# EAGLE design OpenEEW sensor board - ethernet (EAGLE 9.6.2)
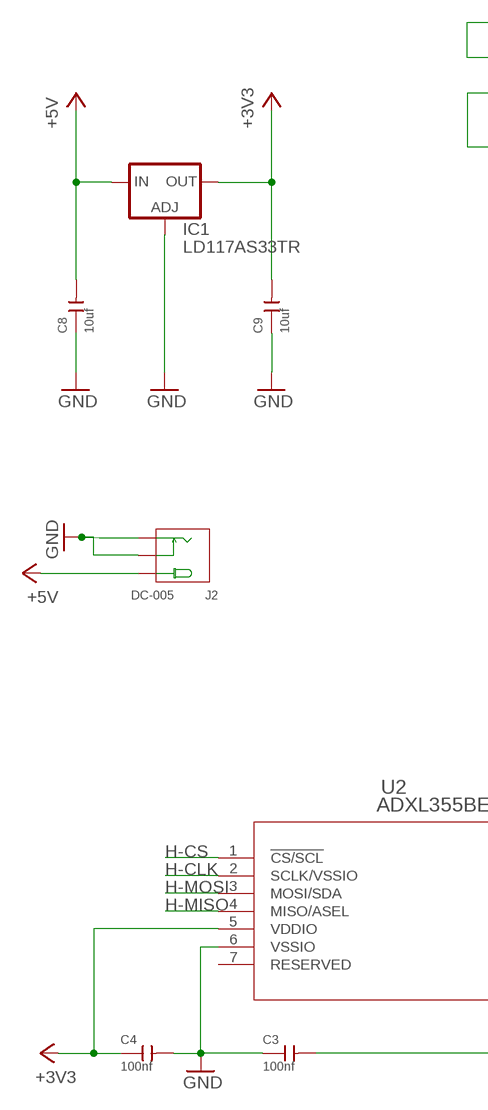
[diagram p0: schematic, sheet 1, part 1 of 2]
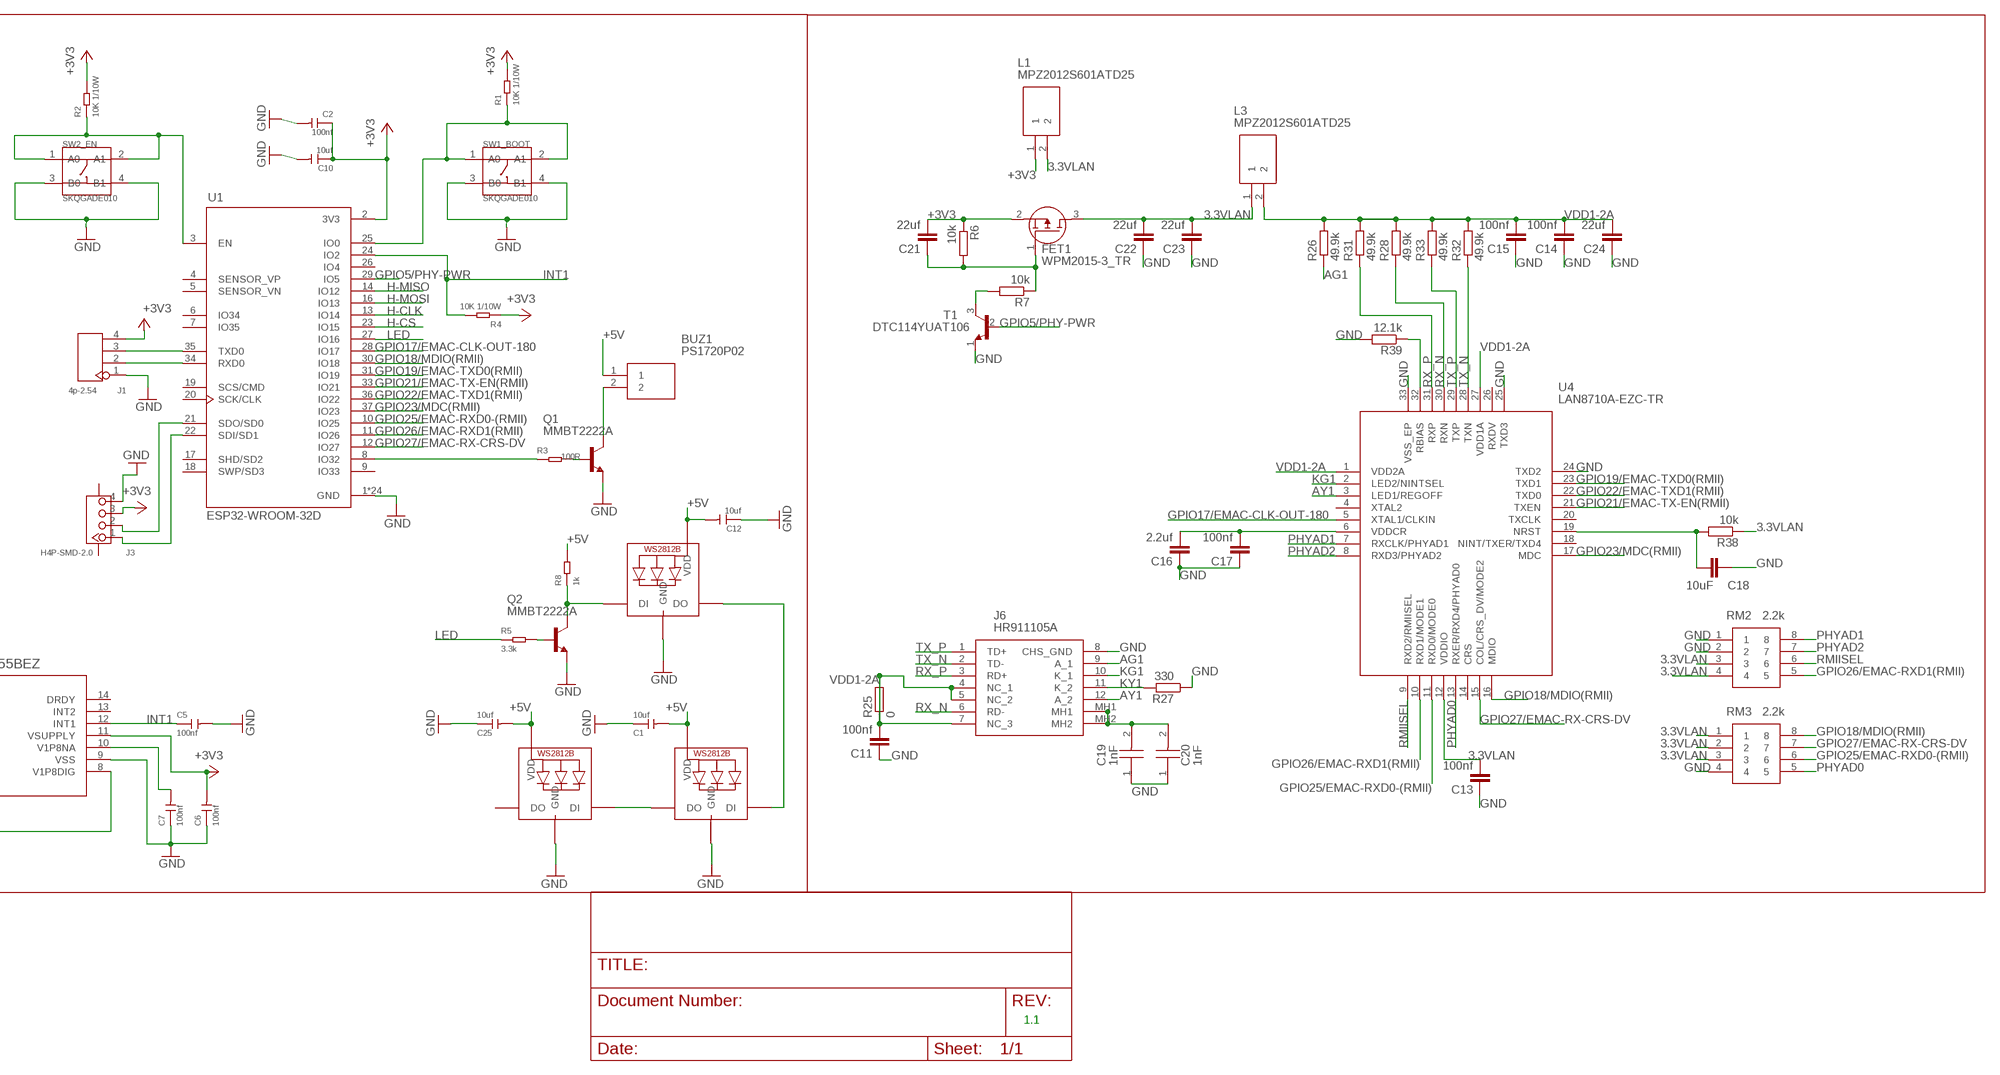
[diagram p1: schematic, sheet 1, part 2 of 2]

## Parts
BUZ1  PS1720P02  [PS17_1]
C1  10uf  CERAMIC-10UF-10V-10%-X5R(0603)  [C0603]
C2  100nf  CERAMIC-100NF-50V-10%-X7R(0603)  [C0603]
C3  100nf  CERAMIC-100NF-50V-10%-X7R(0603)  [C0603]
C4  100nf  CERAMIC-100NF-50V-10%-X7R(0603)  [C0603]
C5  100nf  CERAMIC-100NF-50V-10%-X7R(0603)  [C0603]
C6  100nf  CERAMIC-100NF-50V-10%-X7R(0603)  [C0603]
C7  100nf  CERAMIC-100NF-50V-10%-X7R(0603)  [C0603]
C8  10uf  CERAMIC-10UF-10V-10%-X5R(0603)  [C0603]
C9  10uf  CERAMIC-10UF-10V-10%-X5R(0603)  [C0603]
C10  10uf  CERAMIC-10UF-10V-10%-X5R(0603)  [C0603]
C11  100nf  C-EUC0603  [C0603]
C12  10uf  CERAMIC-10UF-10V-10%-X5R(0603)  [C0603]
C13  100nf  C-EUC0603  [C0603]
C14  100nf  C-EUC0603  [C0603]
C15  100nf  C-EUC0603  [C0603]
C16  2.2uf  C-EUC0603  [C0603]
C17  100nf  C-EUC0603  [C0603]
C18  10uF  C-EUC0603  [C0603]
C19  1nF  1206GC102KAT1A  [CAPC3317X180N]
C20  1nF  1206GC102KAT1A  [CAPC3317X180N]
C21  22uf  C-EUC0805  [C0805]
C22  22uf  C-EUC0805  [C0805]
C23  22uf  C-EUC0805  [C0805]
C24  22uf  C-EUC0603  [C0603]
C25  10uf  CERAMIC-10UF-10V-10%-X5R(0603)  [C0603]
FET1  WPM2015-3_TR  [SOT95P240X130-3N]
IC1  LD117AS33TR  [SOT223]
J1  4p-2.54  DIP-BLACK-MALE-HEADER-VERT(4P-2.54)  [H4-2.54]
J2  DC-005  CONN-POWER-JACK-2.1MM(DC-005)  [DCJ3P-14.2X11.0X9.0MM]
J3  H4P-SMD-2.0  GROVE-CONNECTOR-SMD(4+2P-2.0)  [HW4-SMD-2.0]
J6  HR911105A  [HR911105A]
L1  MPZ2012S601ATD25  [BEADC2012X105N]
L3  MPZ2012S601ATD25  [BEADC2012X105N]
LED1  WS2812B5050  [WS2812B]
LED2  WS2812B5050  [WS2812B]
LED3  WS2812B5050  [WS2812B]
Q1  MMBT2222A  [SOT23]
Q2  MMBT2222A  [SOT23]
R1  10K 1/10W  SMD-RES-10K-5%-1/10W(0603)  [R0603]
R2  10K 1/10W  SMD-RES-10K-5%-1/10W(0603)  [R0603]
R3  100R  SMD-RES-100R-5%-1/8W(0805)  [R0805]
R4  10K 1/10W  SMD-RES-10K-5%-1/10W(0603)  [R0603]
R5  3.3k  SMD-RES-300R-1%-1/10W(0603)  [R0603]
R6  10k  R-EU_R0603  [R0603]
R7  10k  R-EU_R0603  [R0603]
R8  1k  SMD-RES-100R-5%-1/8W(0805)  [R0805]
R25  0  R-EU_R0603  [R0603]
R26  49.9k  R-EU_R0603  [R0603]
R27  330  R-EU_R0603  [R0603]
R28  49.9k  R-EU_R0603  [R0603]
R31  49.9k  R-EU_R0603  [R0603]
R32  49.9k  R-EU_R0603  [R0603]
R33  49.9k  R-EU_R0603  [R0603]
R38  10k  R-EU_R0603  [R0603]
R39  12.1k  R-EU_R0603  [R0603]
RM2  2.2k  CAT10-103J4LF  [CAT10J4LF]
RM3  2.2k  CAT10-103J4LF  [CAT10J4LF]
SW1_BOOT  SKQGADE010  SMD-BUTTON(4P-5.2X5.2X1.5MM-SKQGADE010)-SKQGADE010  [SW4-SMD-5.2X5.2X1.5MM]
SW2_EN  SKQGADE010  SMD-BUTTON(4P-5.2X5.2X1.5MM-SKQGADE010)-SKQGADE010  [SW4-SMD-5.2X5.2X1.5MM]
T1  DTC114YUAT106  [SOT65P210X90-3N]
U1  ESP32-WROOM-32D  [MODULE_ESP32-WROOM-32D]
U2  ADXL355BEZ  [E_14_1_ADI]
U4  LAN8710A-EZC-TR  [QFN50P500X500X100-33N]

## Nets
3.3VLAN: C13.2 C22.2 C23.2 FET1.3(D) L1.2 L3.1 R38.1 RM2.3 RM2.4 RM3.1 RM3.2 RM3.3 U4.12(VDDIO)
+3V3: C2.1 C4.1 C6.2 C9.2 C10.1 C21.2 FET1.2(S) IC1.4(OUT) J1.4 J3.3 L1.1 R1.2 R2.2 R4.1 R6.1 U1.2(3V3) U2.5(VDDIO) U2.11(VSUPPLY)
+5V: BUZ1.1 C1.2 C8.2 C12.2 C25.2 IC1.3(IN) J2.+ LED1.1-VDD(VDD) LED2.1-VDD(VDD) LED3.1-VDD(VDD) R8.2
AG1: J6.9(A_1) R26.1
AY1: J6.12(A_2) U4.3(LED1/REGOFF)
GND: C1.1 C2.2 C3.1 C4.2 C5.2 C6.1 C7.1 C8.1 C9.1 C10.2 C11.1 C12.1 C13.1 C14.1 C15.1 C16.1 C17.1 C18.1 C19.1 C20.1 C22.1 C23.1 C24.1 C25.1 IC1.1(ADJ) J1.1 J2.-1(-) J2.-2(CDN) J3.4 J6.8(CHS_GND) LED1.3-GND(GND) LED2.3-GND(GND) LED3.3-GND(GND) Q1.2(E) Q2.2(E) R27.1 R39.2 RM2.1 RM2.2 RM3.4 SW1_BOOT.3(B0) SW1_BOOT.4(B1) SW2_EN.3(B0) SW2_EN.4(B1) T1.1(E) U1.1(GND) U1.15(GND) U1.38(GND) U1.39_1(GND) U1.39_2(GND) U1.39_3(GND) U1.39_4(GND) U1.39_5(GND) U1.39_6(GND) U1.39_7(GND) U1.39_8(GND) U1.39_9(GND) U1.39_10(GND) U1.39_11(GND) U1.39_12(GND) U1.39_13(GND) U1.39_14(GND) U1.39_15(GND) U1.39_16(GND) U1.39_17(GND) U1.39_18(GND) U1.39_19(GND) U1.39_20(GND) U1.39_21(GND) U2.6(VSSIO) U2.9(VSS) U4.24(TXD2) U4.25(TXD3) U4.33(VSS_EP)
GPIO5/PHY-PWR: T1.2(B) U1.29(IO5)
GPIO17/EMAC-CLK-OUT-180: U1.28(IO17) U4.5(XTAL1/CLKIN)
GPIO18/MDIO(RMII): RM3.8 U1.30(IO18) U4.16(MDIO)
GPIO19/EMAC-TXD0(RMII): U1.31(IO19) U4.23(TXD1)
GPIO21/EMAC-TX-EN(RMII): U1.33(IO21) U4.21(TXEN)
GPIO22/EMAC-TXD1(RMII): U1.36(IO22) U4.22(TXD0)
GPIO23/MDC(RMII): U1.37(IO23) U4.17(MDC)
GPIO25/EMAC-RXD0-(RMII): RM3.6 U1.10(IO25) U4.11(RXD0/MODE0)
GPIO26/EMAC-RXD1(RMII): RM2.5 U1.11(IO26) U4.10(RXD1/MODE1)
GPIO27/EMAC-RX-CRS-DV: RM3.7 U1.12(IO27) U4.15(COL/CRS_DV/MODE2)
H-CLK: U1.13(IO14) U2.2(SCLK/VSSIO)
H-CS: U1.23(IO15) U2.1(!CS/SCL)
H-MISO: U1.14(IO12) U2.4(MISO/ASEL)
H-MOSI: U1.16(IO13) U2.3(MOSI/SDA)
INT1: C5.1 R4.2 U1.24(IO2) U2.12(INT1)
KG1: J6.10(K_1) U4.2(LED2/NINTSEL)
KY1: J6.11(K_2) R27.2
LED: R5.1 U1.27(IO16)
N$1: C3.2 U2.8(V1P8DIG)
N$2: R1.1 SW1_BOOT.1(A0) SW1_BOOT.2(A1) U1.25(IO0)
N$3: C7.2 U2.10(V1P8NA)
N$4: R3.1 U1.8(IO32)
N$5: R2.1 SW2_EN.1(A0) SW2_EN.2(A1) U1.3(EN)
N$6: Q1.1(B) R3.2
N$7: J1.3 U1.35(TXD0)
N$8: J1.2 U1.34(RXD0)
N$9: J3.1 U1.22(SDI/SD1)
N$10: J3.2 U1.21(SDO/SD0)
N$11: LED1.4-DIN(DI) Q2.3(C) R8.1
N$12: BUZ1.2 Q1.3(C)
N$13: R7.2 T1.3(C)
N$14: Q2.1(B) R5.2
N$15: C16.2 C17.2 U4.6(VDDCR)
N$16: C21.1 FET1.1(G) R6.2 R7.1
N$17: LED1.2-DOUT(DO) LED2.4-DIN(DI)
N$18: C19.2 C20.2 J6.MH1 J6.MH2
N$19: LED2.2-DOUT(DO) LED3.4-DIN(DI)
N$25: C18.2 R38.2 U4.19(NRST)
N$26: R39.1 U4.32(RBIAS)
PHYAD0: RM3.5 U4.13(RXER/RXD4/PHYAD0)
PHYAD1: RM2.8 U4.7(RXCLK/PHYAD1)
PHYAD2: RM2.7 U4.8(RXD3/PHYAD2)
RMIISEL: RM2.6 U4.9(RXD2/RMIISEL)
RX_N [diff pairs]: J6.6(RD-) R28.1 U4.30(RXN)
RX_P [diff pairs]: J6.3(RD+) R31.1 U4.31(RXP)
TX_N [diff pairs]: J6.2(TD-) R32.1 U4.28(TXN)
TX_P [diff pairs]: J6.1(TD+) R33.1 U4.29(TXP)
VDD1-2A [diff pairs]: C11.2 C14.2 C15.2 C24.2 J6.4(NC_1) J6.5(NC_2) J6.7(NC_3) L3.2 R25.1 R25.2 R26.2 R28.2 R31.2 R32.2 R33.2 U4.1(VDD2A) U4.27(VDD1A)
Unconnected: J3.SS1 J3.SS2 LED3.2-DOUT(DO) U1.4(SENSOR_VP) U1.5(SENSOR_VN) U1.6(IO34) U1.7(IO35) U1.9(IO33) U1.17(SHD/SD2) U1.18(SWP/SD3) U1.19(SCS/CMD) U1.20(SCK/CLK) U1.26(IO4) U2.7(RESERVED) U2.13(INT2) U2.14(DRDY) U4.4(XTAL2) U4.14(CRS) U4.18(NINT/TXER/TXD4) U4.20(TXCLK) U4.26(RXDV)

## Notes on the sheet
- 1.1

## Library data of the parts
BUZ1 = SamacSys_Parts:PS1720P02: Piezoelectronic buzzers Pin terminal/Lead lines/SMD(Without oscillator circuit) Source: Datasheet <https://product.tdk.com/info/en/catalog/datasheets/piezoelectronic_buzzer_ps_en.pdf>; ARROW_PART_NUMBER: PS1720P02; ARROW_PRICE-STOCK: https://www.arrow.com/en/products/ps1720p02/tdk; DESCRIPTION: Piezoelectronic buzzers Pin terminal/Lead lines/SMD(Without oscillator circuit); HEIGHT: mm; MANUFACTURER_NAME: TDK; MANUFACTURER_PART_NUMBER: PS1720P02; MOUSER_PART_NUMBER: 810-PS1720P02; MOUSER_PRICE-STOCK: https://www.mouser.co.uk/ProductDetail/TDK/PS1720P02?qs=Ys7FABonMR4G5gkQPbK3uw%3D%3D
C1 C8-C10 C12 C25 = OPL_Capacitor:CERAMIC-10UF-10V-10%-X5R(0603): 302010103; MPN: CC0603KRX5R6BB106
C2-C7 = OPL_Capacitor:CERAMIC-100NF-50V-10%-X7R(0603): 302010138; MPN: CC0603KRX7R9BB104
C11 C13-C18 C21-C24 = rcl:C-EU: CAPACITOR, European symbol; SPICEPREFIX: C
C19 C20 = SamacSys_Parts:1206GC102KAT1A: 1206 X7R ceramic capacitor, 2kV 1nF AVX 1206 FlEXITERM 1nF Ceramic Multilayer Capacitor, 2000 V dc, +125C, X7R Dielectric, +/-10% SMD Source: Datasheet <https://componentsearchengine.com/Datasheets/2/1206GC102KAT1A.pdf>; ARROW_PART_NUMBER: 1206GC102KAT1A; ARROW_PRICE-STOCK: https://www.arrow.com/en/products/1206gc102kat1a/avx; DESCRIPTION: 1206 X7R ceramic capacitor, 2kV 1nF AVX 1206 FlEXITERM 1nF Ceramic Multilayer Capacitor, 2000 V dc, +125C, X7R Dielectric, +/-10% SMD; HEIGHT: 1.8mm; MANUFACTURER_NAME: AVX; MANUFACTURER_PART_NUMBER: 1206GC102KAT1A; MOUSER_PART_NUMBER: 581-1206GC102K; MOUSER_PRICE-STOCK: https://www.mouser.com/Search/Refine.aspx?Keyword=581-1206GC102K
FET1 = SamacSys_Parts:WPM2015-3_TR: MOSFET P Trench 20V 2.2A 810mV @ 250uA 110 m @ 2.7A,4.5V SOT-23(SOT-23-3) RoHS Source: Datasheet <https://lcsc.com/product-detail/MOSFET_Will-Semicon-WPM2015-3-TR_C213159.html>; ARROW_PART_NUMBER: WPM2015-3/TR; DESCRIPTION: MOSFET P Trench 20V 2.2A 810mV @ 250uA 110 m @ 2.7A,4.5V SOT-23(SOT-23-3) RoHS; HEIGHT: 1.3mm; MANUFACTURER_NAME: Will Semiconductor; MANUFACTURER_PART_NUMBER: WPM2015-3/TR
IC1 = v-reg:LD117A?*: Low drop fixed and adjustable positive voltage regulators 1 A Source: http://www.st.com/stonline/products/literature/ds/7194/ld1117axx.pdf
J1 = OPL_Connector:DIP-BLACK-MALE-HEADER-VERT(4P-2.54): 320020017; MPN: P125-1104A0BS116A1
J2 = OPL_Connector:CONN-POWER-JACK-2.1MM(DC-005): 320120003; MPN: DC-005
J3 = OPL_Connector@1:GROVE-CONNECTOR-SMD(4+2P-2.0): 320110030
J6 = SamacSys_Parts:HR911105A: Through Hole Ethernet Connectors/Modular Connectors (RJ45 RJ11) Source: Datasheet <https://datasheet.lcsc.com/szlcsc/Zhongshan-HanRun-Elec-HR911105A_C12074.pdf>; ARROW_PART_NUMBER: HR911105A; DESCRIPTION: Through Hole Ethernet Connectors/Modular Connectors (RJ45 RJ11); HEIGHT: 13.75mm; MANUFACTURER_NAME: HANRUN(Zhongshan HanRun Elec); MANUFACTURER_PART_NUMBER: HR911105A
L1 L3 = SamacSys_Parts:MPZ2012S601ATD25: Ferrite Beads Multi-Layer Power 600Ohm 25% 100MHz 2A 100mOhm DCR 0805 Automotive T/R Source: Datasheet <https://www.arrow.com/en/products/mpz2012s601atd25/tdk>; ARROW_PART_NUMBER: MPZ2012S601ATD25; ARROW_PRICE-STOCK: https://www.arrow.com/en/products/mpz2012s601atd25/tdk; DESCRIPTION: Ferrite Beads Multi-Layer Power 600Ohm 25% 100MHz 2A 100mOhm DCR 0805 Automotive T/R; HEIGHT: 1.05mm; MANUFACTURER_NAME: TDK; MANUFACTURER_PART_NUMBER: MPZ2012S601ATD25; MOUSER_PART_NUMBER: 810-MPZ2012S601ATD25; MOUSER_PRICE-STOCK: https://www.mouser.co.uk/ProductDetail/TDK/MPZ2012S601ATD25?qs=n0%2F4YYxsltT7vo9AjVUU7w%3D%3D
LED1-LED3 = adafruit:WS2812B
Q1 Q2 = MMBT2222A:MMBT2222A: 2N2222 General Purpose NPN Transistor; AVAILABILITY: Unavailable; DESCRIPTION: Bipolar (BJT) Transistor NPN 40V 600mA 300MHz 310mW Surface Mount SOT-23-3; MF: STMicroelectronics; MP: MMBT2222A; PACKAGE: TO-236-3 Taitron; PRICE: None
R1 R2 R4 = OPL_Resistor:SMD-RES-10K-5%-1/10W(0603): 301010293; MPN: RC0603JR-0710KL
R3 = OPL_Resistor:SMD-RES-100R-5%-1/8W(0805): 301010319; MPN: RC0805JR-07100RL
R5 = OPL_Resistor:SMD-RES-300R-1%-1/10W(0603): 301012063; MPN: RC0603FR-071K5L; VALUE: 1.5K
R6 R7 R25-R28 R31-R33 R38 R39 = rcl:R-EU_: RESISTOR, European symbol; SPICEPREFIX: R
R8 = OPL_Resistor:SMD-RES-100R-5%-1/8W(0805): 301010319; MPN: RC0805JR-07100RL; VALUE: 100R
RM2 RM3 = SamacSys_Parts:CAT10-103J4LF: 10k 0804 Thick Film Surface Mount Fixed Resistor +/-5% 0.0625W CAT10-103J4LF Source: Datasheet <https://www.bourns.com/pdfs/CAT10.pdf>; ARROW_PART_NUMBER: CAT10-103J4LF; ARROW_PRICE-STOCK: https://www.arrow.com/en/products/cat10-103j4lf/bourns; DESCRIPTION: 10k 0804 Thick Film Surface Mount Fixed Resistor +/-5% 0.0625W CAT10-103J4LF; HEIGHT: 0.55mm; MANUFACTURER_NAME: Bourns; MANUFACTURER_PART_NUMBER: CAT10-103J4LF; MOUSER_PART_NUMBER: 652-CAT10-103J4LF; MOUSER_PRICE-STOCK: https://www.mouser.co.uk/ProductDetail/Bourns/CAT10-103J4LF?qs=2W%2FSxbYhP0bqukjaie6S3A%3D%3D
SW1_BOOT SW2_EN = OPL_Switch:SMD-BUTTON(4P-5.2X5.2X1.5MM-SKQGADE010): 311020017; MPN: SKQGADE010
T1 = SamacSys_Parts:DTC114YUAT106: Rohm, Bip, Tr., BRT, DTC114YUAT106 ROHM, DTC114YUAT106 NPN Digital Transistor, 100 mA 50 V 10 kOhm, Ratio Of 4.7, 3-Pin SOT-323 Source: Datasheet <http://rohmfs.rohm.com/en/products/databook/datasheet/discrete/transistor/digital/dtc114yuat106-e.pdf>; ARROW_PART_NUMBER: DTC114YUAT106; DESCRIPTION: Rohm, Bip, Tr., BRT, DTC114YUAT106 ROHM, DTC114YUAT106 NPN Digital Transistor, 100 mA 50 V 10 kOhm, Ratio Of 4.7, 3-Pin SOT-323; HEIGHT: 0.9mm; MANUFACTURER_NAME: ROHM Semiconductor; MANUFACTURER_PART_NUMBER: DTC114YUAT106; MOUSER_PART_NUMBER: 755-DTC114YUAT106; MOUSER_PRICE-STOCK: https://www.mouser.co.uk/ProductDetail/ROHM-Semiconductor/DTC114YUAT106?qs=4kLU8WoGk0saqLEiRl69QA%3D%3D
U1 = andylib:ESP32-WROOM-32D: Bluetooth, WiFi 802.11b/g/n, Bluetooth v4.2 + EDR, Class 1, 2 and 3 Transceiver Module 2.4GHz ~ 2.5GHz Integrated, Trace Surface Mount; AVAILABILITY: Unavailable; DESCRIPTION: Bluetooth, WiFi 802.11b/g/n, Bluetooth v4.2 +EDR, Class 1, 2 and 3 Transceiver Module 2.4GHz ~ 2.5GHz Integrated, Trace Surface Mount; DIGIKEY-PURCHASE-URL: https://snapeda.com/shop?store=DigiKey&id=2768115; MF: Espressif Systems; MP: ESP32-WROOM-32D; PACKAGE: Module Espressif Systems; PRICE: None
U2 = andylib:ADXL355BEZ; BUILT_BY: Analog_Devices_Team; COPYRIGHT: Copyright (C) 2018 Accelerated Designs. All rights reserved; MANUFACTURER_PART_NUMBER: ADXL355BEZ; SOURCELIBRARY: Analog_Devices_2019-04-17; VENDOR: Analog Devices Inc
U4 = SamacSys_Parts:LAN8710A-EZC-TR: Ethernet ICs 10/100 Ethernet XCVR HP AutoMDIX FlexPwr Source: Datasheet <http://docs-emea.rs-online.com/webdocs/13a0/0900766b813a037a.pdf>; ARROW_PART_NUMBER: LAN8710A-EZC-TR; ARROW_PRICE-STOCK: https://www.arrow.com/en/products/lan8710a-ezc-tr/microchip-technology; DESCRIPTION: Ethernet ICs 10/100 Ethernet XCVR HP AutoMDIX FlexPwr; HEIGHT: 1mm; MANUFACTURER_NAME: Microchip; MANUFACTURER_PART_NUMBER: LAN8710A-EZC-TR; MOUSER_PART_NUMBER: 886-LAN8710A-EZC-TR; MOUSER_PRICE-STOCK: https://www.mouser.co.uk/ProductDetail/Microchip-Technology/LAN8710A-EZC-TR?qs=pA5MXup5wxGKmFN1hVUOmA%3D%3D

## Net classes
1 diff pairs: width 0.203 mm
2 Power: width 1 mm
3 signal: width 0.5 mm

## Board
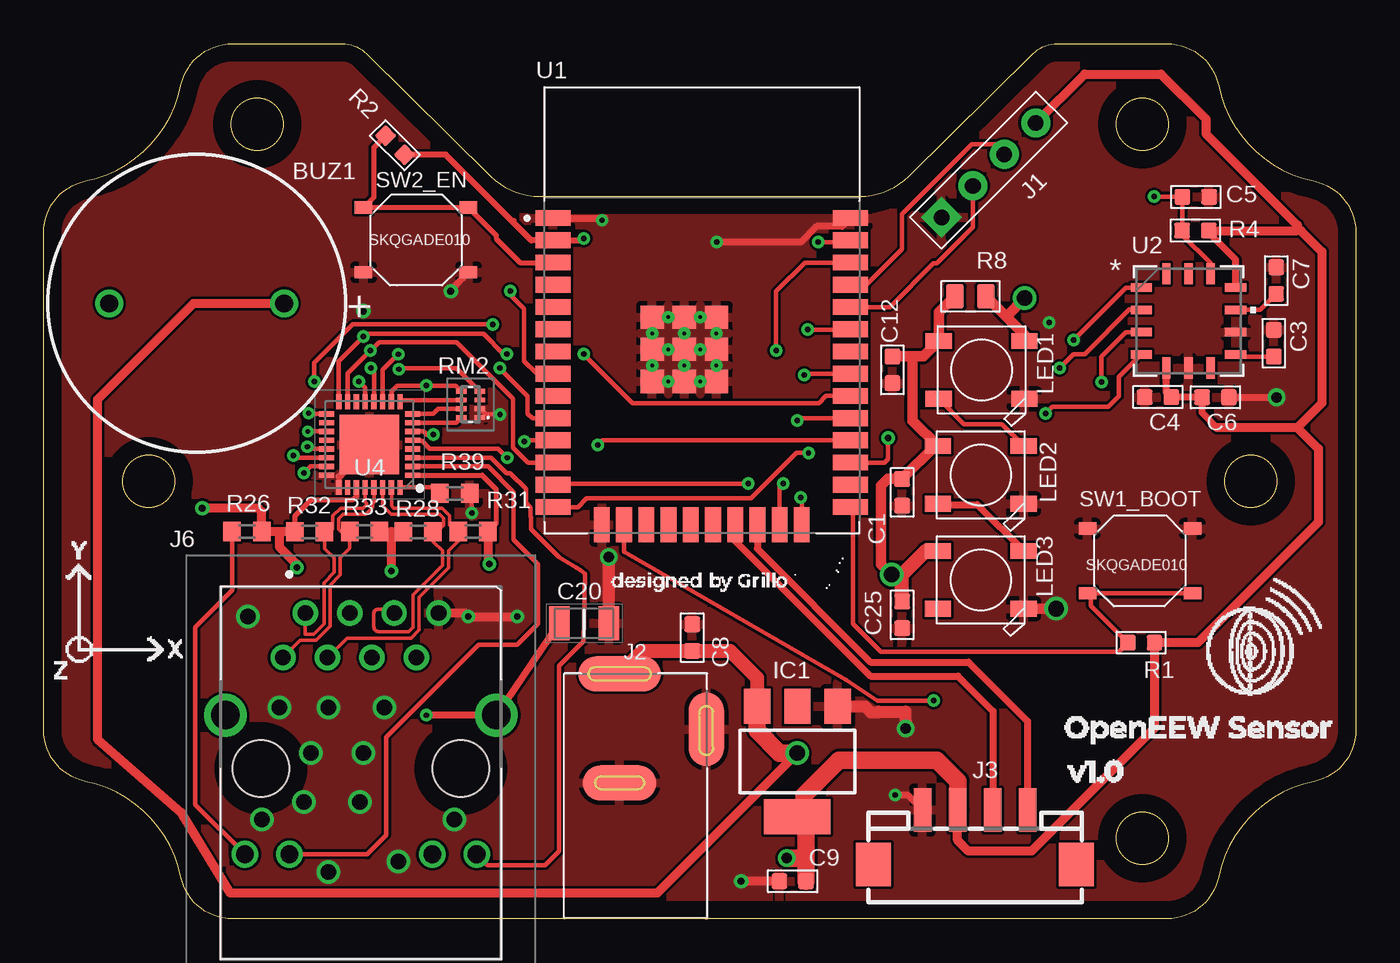
[diagram p2: board, top side]
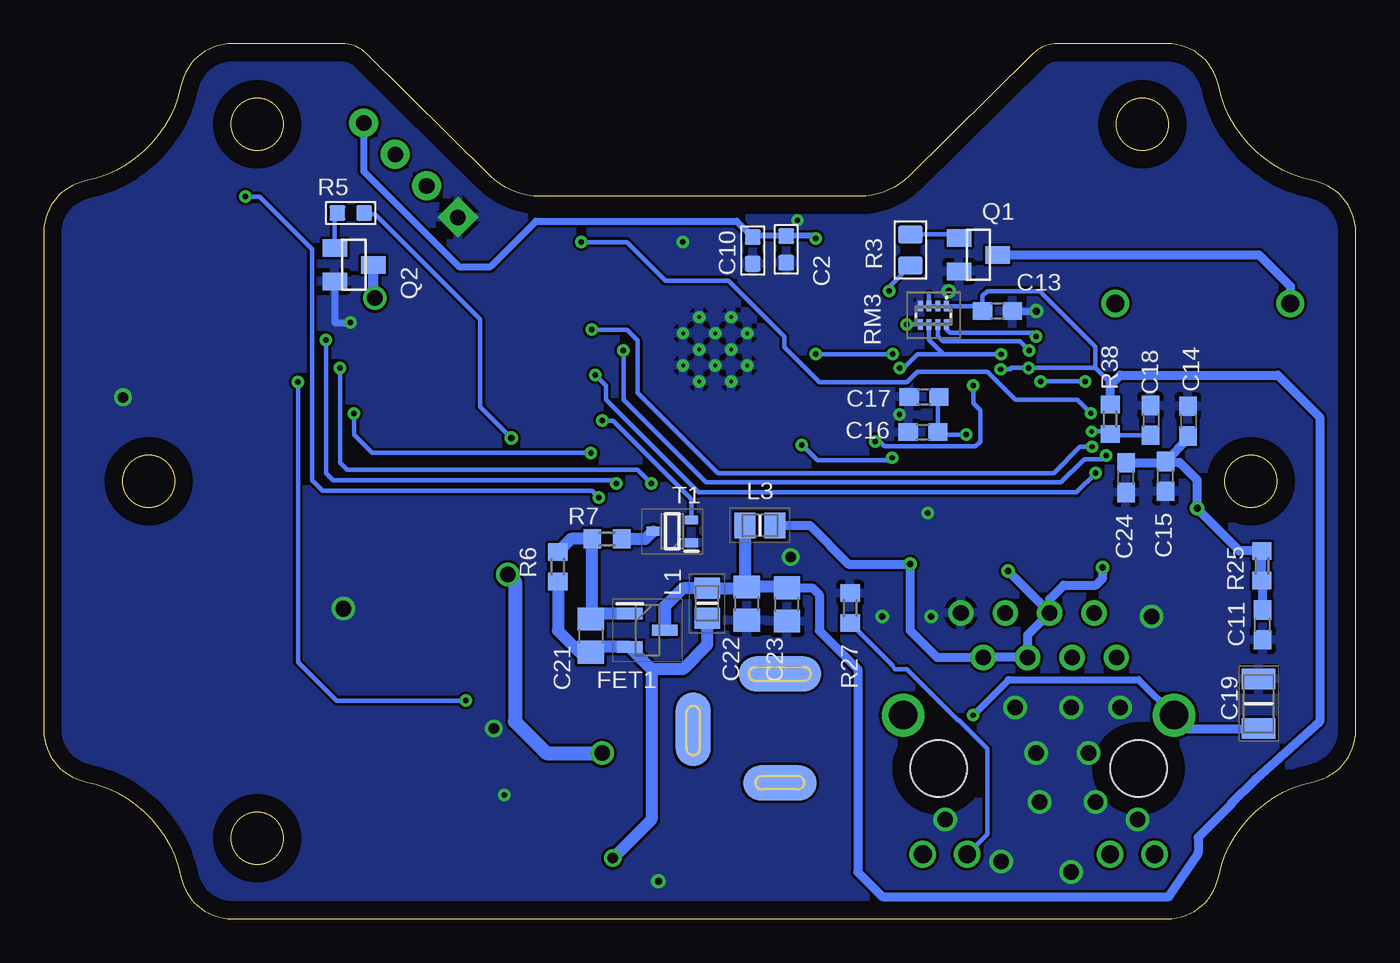
[diagram p3: board, bottom side, seen from below]

Size 75 x 50 mm. Coordinates in mm from the lower left corner, seen from the top.
Outline: 2.4,7.84 arc-78 0,10.78 0,39.23 arc-78 2.4,42.16 arc67 7.84,47.6 arc-78 10.78,50 17.05,50 arc-45 18.45,49.42 25.54,42.44 arc45 28.35,41.29 46.65,41.29 arc45 49.46,42.44 56.55,49.42 arc-45 57.95,50 64.22,50 arc-78 67.16,47.6 arc67 72.6,42.16 arc-78 75,39.23 75,10.78 arc-78 72.6,7.84 arc67 67.16,2.4 arc-78 64.22,0 10.78,0 arc-78 7.84,2.4 arc67 2.4,7.84
Outline: circle at 6,25 radius 1.5
Outline: circle at 12.2,45.4 radius 1.5
Outline: circle at 62.8,4.6 radius 1.5
Outline: circle at 69,25 radius 1.5
Outline: circle at 62.8,45.4 radius 1.5
Copper layers (1*16): Top 0.035mm / dielectric 1.5mm / Bottom 0.035mm
Design rules "default *": minimum track width 6mil, minimum drill 6mil, track to track 6mil, track to pad 6mil, pad to pad 6mil, via to via 6mil, smd to smd 6mil, copper to edge 40mil, drill to drill 6mil, minimum pad ring 10mil, minimum via ring 8mil, stop-mask expansion 4mil, vias tented up to drill 0mil, thermal gap 10mil

### Footprints (pad centres in the part's own frame; a part is rotated, then mirrored left to right if it is on the bottom)
PS17_1 = drill 1.02 pad 1.58: 1 -5,0; 2 5,0
C0603 = smd 0.889 x 0.889: 1 0,0.762; 2 0,-0.762
C0603' = smd 1.1 x 1: 1 -0.85,0; 2 0.85,0
CAPC3317X180N = smd 1.17 x 1.92: 1 -1.42,0; 2 1.42,0
C0805 = smd 1.3 x 1.5: 1 -0.95,0; 2 0.95,0
SOT95P240X130-3N = smd 1.45 x 0.65: 1 -1,0.95; 2 -1,-0.95; 3 1,0
SOT223 = smd 1.5 x 2: 1 -2.3,-3.15; 2 0,-3.15; 3 2.3,-3.15 | smd 3.8 x 2: 4 0,3.15
H4-2.54 = drill 0.889 pad 1.651 square: 1 0,3.81 | drill 0.889 pad 1.651: 2 0,1.27; 3 0,-1.27; 4 0,-3.81
DCJ3P-14.2X11.0X9.0MM = smd 2 x 4.7: + 3.175,0 | smd 2 x 4.7 bottom: +1 3.175,0 | smd 2 x 4.2: -1 -3.048,0 | smd 4.2 x 2: -2 0,-4.953 | smd 2 x 4.2 bottom: -3 -3.048,0 | smd 4.2 x 2 bottom: -4 0,-4.953
HW4-SMD-2.0 = smd 1 x 2.5: 1 -3,0; 2 -1,0; 3 1,0; 4 3,0 | smd 2 x 2.5: SS1 -5.8,3.123; SS2 5.8,3.123
HR911105A = drill 0.89 pad 1.446: 1 0,0; 2 -1.27,-2.54; 3 -2.54,0; 4 -3.81,-2.54; 5 -5.08,0; 6 -6.35,-2.54; 7 -7.62,0; 8 -8.89,-2.54 | drill 1.02 pad 1.53: 9 2.18,11.25; 10 -0.36,11.25; 11 -8.53,11.25; 12 -11.07,11.25 | drill 1.63 pad 2.445: MH1 -12.19,3.3; MH2 3.3,3.3 | hole 3.25: 1.27,6.35; -10.16,6.35
BEADC2012X105N = smd 1.2 x 1.45: 1 -0.85,0; 2 0.85,0
WS2812B = smd 1.5 x 0.9: 1-VDD 2.45,-1.65; 2-DOUT 2.45,1.65; 3-GND -2.45,1.65; 4-DIN -2.45,-1.65
SOT23 = smd 1 x 1.4: 1 -0.95,-1.1; 2 0.95,-1.1; 3 0,1.1
R0603 = smd 0.889 x 0.889: 1 0,0.762; 2 0,-0.762
R0805 = smd 1.397 x 1.016: 1 0,0.889; 2 0,-0.889
R0603' = smd 1 x 1.1: 1 -0.85,0; 2 0.85,0
CAT10J4LF = smd 0.275 x 0.6: 1 -0.75,-0.525; 2 -0.25,-0.525; 3 0.25,-0.525; 4 0.75,-0.525; 5 0.75,0.525; 6 0.25,0.525; 7 -0.25,0.525; 8 -0.75,0.525
SW4-SMD-5.2X5.2X1.5MM = smd 1 x 0.7: 1 -3,1.85; 2 3,1.85; 3 -3,-1.85; 4 3,-1.85
SOT65P210X90-3N = smd 0.75 x 0.5: 1 -1.1,0.65; 2 -1.1,-0.65; 3 1.1,0
MODULE_ESP32-WROOM-32D = smd 2 x 0.9: 1 -8.5,5.26; 2 -8.5,3.99; 3 -8.5,2.72; 4 -8.5,1.45; 5 -8.5,0.18; 6 -8.5,-1.09; 7 -8.5,-2.36; 8 -8.5,-3.63; 9 -8.5,-4.9; 10 -8.5,-6.17; 11 -8.5,-7.44; 12 -8.5,-8.71; 13 -8.5,-9.98; 14 -8.5,-11.25; 25 8.5,-11.25; 26 8.5,-9.98; 27 8.5,-8.71; 28 8.5,-7.44; 29 8.5,-6.17; 30 8.5,-4.9; 31 8.5,-3.63; 32 8.5,-2.36; 33 8.5,-1.09; 34 8.5,0.18; 35 8.5,1.45; 36 8.5,2.72; 37 8.5,3.99; 38 8.5,5.26 | smd 0.9 x 2: 15 -5.715,-12.25; 16 -4.445,-12.25; 17 -3.175,-12.25; 18 -1.905,-12.25; 19 -0.635,-12.25; 20 0.635,-12.25; 21 1.905,-12.25; 22 3.175,-12.25; 23 4.445,-12.25; 24 5.715,-12.25 | smd 1.33 x 1.33: 39_1 -2.835,-0.405; 39_2 -1,-0.405; 39_3 0.835,-0.405; 39_4 -2.835,-2.24; 39_5 -1,-2.24; 39_6 0.835,-2.24; 39_7 -2.835,-4.075; 39_8 -1,-4.075; 39_9 0.835,-4.075 | drill 0.2 pad 0.3: 39_10 -1.917,-0.405; 39_11 -0.083,-0.405; 39_12 -2.835,-1.323; 39_13 -1,-1.323; 39_14 0.835,-1.323; 39_15 -1.917,-2.24; 39_16 -0.083,-2.24; 39_17 -2.835,-3.158; 39_18 -1,-3.158; 39_19 0.835,-3.158; 39_20 -1.917,-4.075; 39_21 -0.083,-4.075
E_14_1_ADI = smd 1.219 x 0.483: 1 -2.695,1.905; 2 -2.695,0.635; 3 -2.695,-0.635; 4 -2.695,-1.905; 8 2.695,-1.905; 9 2.695,-0.635; 10 2.695,0.635; 11 2.695,1.905 | smd 0.483 x 1.219: 5 -1.27,-2.695; 6 0,-2.695; 7 1.27,-2.695; 12 1.27,2.695; 13 0,2.695; 14 -1.27,2.695
QFN50P500X500X100-33N = smd 0.85 x 0.3: 1 -2.45,1.75; 2 -2.45,1.25; 3 -2.45,0.75; 4 -2.45,0.25; 5 -2.45,-0.25; 6 -2.45,-0.75; 7 -2.45,-1.25; 8 -2.45,-1.75; 17 2.45,-1.75; 18 2.45,-1.25; 19 2.45,-0.75; 20 2.45,-0.25; 21 2.45,0.25; 22 2.45,0.75; 23 2.45,1.25; 24 2.45,1.75 | smd 0.3 x 0.85: 9 -1.75,-2.45; 10 -1.25,-2.45; 11 -0.75,-2.45; 12 -0.25,-2.45; 13 0.25,-2.45; 14 0.75,-2.45; 15 1.25,-2.45; 16 1.75,-2.45; 25 1.75,2.45; 26 1.25,2.45; 27 0.75,2.45; 28 0.25,2.45; 29 -0.25,2.45; 30 -0.75,2.45; 31 -1.25,2.45; 32 -1.75,2.45 | smd 3.4 x 3.4: 33 0,0

### Placement (x,y rotation side)
BUZ1  8.74,35.16 180 top
C1  49.07,24.37 180 top
C2  32.55,38.25 0 bottom
C3  70.31,32.89 0 top
C4  63.69,29.81 270 top
C5  65.85,41.25 90 top
C6  66.98,29.8 270 top
C7  70.45,36.47 0 top
C8  37.07,16.07 0 top
C9  42.81,2.14 90 top
C10  34.47,38.19 0 bottom
C11  100nf  [C0603']  5.33,16.8 90 bottom
C12  48.51,31.37 180 top
C13  100nf  [C0603']  20.48,34.73 180 bottom
C14  100nf  [C0603']  9.59,28.44 270 bottom
C15  100nf  [C0603']  10.88,25.28 90 bottom
C16  2.2uf  [C0603']  24.73,27.81 0 bottom
C17  100nf  [C0603']  24.68,29.83 0 bottom
C18  10uF  [C0603']  11.73,28.48 270 bottom
C19  5.55,12.29 270 bottom
C20  30.89,16.89 180 top
C21  43.73,16.18 270 bottom
C22  34.81,18.01 90 bottom
C23  32.51,17.96 90 bottom
C24  22uf  [C0603']  13.13,25.21 90 bottom
C25  49.07,17.37 180 top
FET1  40.49,16.49 0 bottom
IC1  43.08,8.99 180 top
J1  54.01,42.78 135 top
J2  32.92,10.82 90 top
J3  53.24,6.22 180 top
J6  13.68,14.93 180 top
L1  37.08,18.03 90 bottom
L3  34.06,22.48 0 bottom
LED1  53.61,31.36 180 top
LED2  53.57,25.37 180 top
LED3  53.57,19.37 180 top
Q1  21.58,37.94 270 bottom
Q2  57.27,37.37 270 bottom
R1  62.73,15.78 90 top
R2  20.08,44.21 45 top
R3  25.46,38.22 180 bottom
R4  65.83,39.33 270 top
R5  57.45,40.33 270 bottom
R6  10k  [R0603']  45.61,20.12 90 bottom
R7  10k  [R0603']  42.8,21.71 0 bottom
R8  52.97,35.57 270 top
R25  0  [R0603']  5.37,20.17 270 bottom
R26  49.9k  [R0603']  11.61,22.13 0 top
R27  330  [R0603']  28.9,17.76 270 bottom
R28  49.9k  [R0603']  21.41,22.11 180 top
R31  49.9k  [R0603']  24.54,22.13 0 top
R32  49.9k  [R0603']  15.21,22.11 180 top
R33  49.9k  [R0603']  18.34,22.13 0 top
R38  10k  [R0603']  14.03,28.54 270 bottom
R39  12.1k  [R0603']  23.5,24.31 0 top
RM2  24.4,29.39 90 top
RM3  24.14,34.48 180 bottom
SW1_BOOT  62.67,20.45 180 top
SW2_EN  21.28,38.79 0 top
T1  39.07,22.14 180 bottom
U1  37.62,34.78 0 top
U2  65.44,34.16 0 top
U4  18.62,27.09 180 top

### Tracks (layer width: path | path; a pad name or v marks a point on that pad's centre or on a via)
3.3VLAN  (via drill 0.3)
  Top 0.254: RM2.3 RM2.4 23.59,31.47 20.37,31.47 v20.31,31.4 | v18.7,31.47 18.88,31.3 U4.12
  Bottom 0.254: 14.9,31.47 14.03,30.61 | 14.9,31.47 v18.7,31.47 19.67,31.47 | 14.9,31.47 14.9,32.7 18.07,35.87 21.07,35.87 21.33,35.61 C13.2 21.61,35.01 RM3.1 RM3.2 RM3.3 24.39,35.67 | 19.67,31.47 19.7,31.47 | v20.31,31.4 19.74,31.4 19.67,31.47
  Bottom 0.5: R38.1 14.03,30.61 13.93,30.61 13.47,31.07 4.47,31.07 2.07,28.67 2.07,11.26 5.72,7.98 7.13,6.57 7.13,6.52 9.01,4.64 9.01,3.75 10.67,1.27 10.68,1.27 27.07,1.27 28.47,2.67 28.47,14.27 30.67,16.47 30.67,18.51 31.07,18.91 C23.2
  Bottom 0.7: C22.2 34.89,18.88 L1.2 38.47,18.88 39.49,17.86 FET1.3 | L3.1 34.91,19.06 C22.2 | C23.2 32.56,18.96 C22.2
+3V3  (via drill 0.3, 0.6)
  Top 0.35: v30.87,38.87 30.87,38.77 U1.2 27.87,38.77 26.87,39.77 | 26.87,39.77 26.87,39.87 | R2.2 22.97,43.67 26.87,39.77
  Top 0.4: U2.5 64.17,30.09 C4.1 64.46,29.8 C6.2 66.21,28.92 67.07,28.07 | R4.1 66.59,39.2 68.14,37.66 U2.11 | 71.67,39.33 71.87,39.33
  Top 0.5: R4.1 71.67,39.33 71.67,39.63 66.44,44.87 66.44,45.7 63.87,48.27 59.5,48.27 J1.4 | 71.87,39.33 73.07,38.13 73.07,29.47 71.67,28.07 | 71.67,28.07 67.07,28.07 | 71.67,28.07 72.87,26.87 72.87,22.67 65.98,15.78 R1.2 63.49,10.89 56.47,3.87 52.87,3.87 52.24,4.5 J3.3 | 43.37,3.47 43.57,3.27
  Top 1: C9.2 43.57,3.27 43.57,5.35 IC1.4 43.47,6.23 43.47,7.07 45.47,9.07 51.07,9.07 52.27,7.87 52.27,6.25 J3.3 | v42.47,3.47 43.37,3.47
  Bottom 0.35: v30.87,38.87 31.02,39.02 C2.1 34.41,39.02 C10.1
  Bottom 0.4: J1.4 56.71,42.7 51.27,37.27 49.47,37.27 46.87,39.87 35.39,39.87 C10.1
  Bottom 0.7: R6.1 45.61,16.47 44.37,15.23 C21.2 43.42,15.54 FET1.2 41.49,15.49 40.27,14.27 | 40.27,14.27 38.47,14.27 37.08,15.66 L1.1 | v42.47,3.47 40.27,5.67 40.27,14.27
+5V  (via drill 0.9)
  Top 0.254: 49.23,25.13 C1.2
  Top 0.5: BUZ1.1 8.56,35.16 3.07,29.67 3.07,10.27 7.87,6.07 10.67,1.47 35.07,1.47 v43.07,9.47
  Top 0.6: 49.87,32.13 50.28,32.13 LED1.1-VDD 51.16,34.65 R8.2 | 49.87,32.13 C12.2 | 49.87,32.13 49.67,31.93 49.67,28.47 LED2.1-VDD 50.96,27.02 C1.2 48.27,25.13 47.87,24.73 47.87,20.27 v48.47,19.67
  Top 0.8: C25.2 49.07,19.67 | 49.07,19.67 50.42,21.02 LED3.1-VDD | 49.07,19.67 v48.47,19.67 | J2.+ 34.23,15.31 C8.2 39.23,15.31 40.78,13.76 IC1.3
  Top 1: IC1.3 40.78,10.76 42.07,9.47 v43.07,9.47
  Bottom 0.8: v48.47,19.67 48.07,19.27 48.07,11.27 46.27,9.47 v43.07,9.47
AG1
  Top 0.254: R26.1 10.76,18.76 8.67,16.67 8.67,6.51 J6.9
AY1
  Top 0.254: J6.12 25.37,3.07 28.67,3.07 29.47,3.87 29.47,14.47 30.86,15.85 30.94,19.72 30.69,19.93 30.47,20.07 29.47,20.67 27.87,22.27 27.87,22.93 27.84,22.96 27.84,23.5 27.57,23.77 27.57,24.57 26.67,25.47 26.45,25.47 25.58,26.34 U4.3
GND  (via drill 0.3, 0.35, 0.4, 0.6, 0.9)
  Top 0.254: R39.2 24.47,24.19 v24.47,23.19 | v26.09,28.82 25.24,28.82 RM2.2
  Top 0.3: U4.25 16.88,25.27
  Top 0.4: U1.1 32.07,40.04 31.95,39.91 v31.91,39.91 | U1.38 45.65,39.57 44.18,39.57 43.27,38.67 v38.47,38.67 | J3.4 49.39,7.07 v48.67,7.07 | 16.88,25.27 17.47,25.87 17.67,25.87 17.67,26.14 U4.33 | SW2_EN.4 23.27,35.93 v23.27,35.87 | C6.1 v70.47,29.8
  Top 0.5: J6.8 24.07,17.47 v24.27,17.27 v27.07,17.27 | C9.1 v39.87,2.14
  Top 0.6: LED3.3-GND v57.87,17.72
  Top 0.7: IC1.1 46.94,12.14 47.28,11.8 47.69,11.8 47.73,11.84 49.27,11.84 v49.27,10.87 | C20.1 v32.31,20.67
  Bottom 0.4: Q2.2 58.37,34.07 v57.47,34.07 | C13.1 v18.27,34.73
  Bottom 0.5: v27.07,17.27 27.13,17.21
  other vias: 13.47,12.07 16.27,12.07 19.47,12.07 15.27,9.47 18.27,9.47 14.87,6.67 18.07,6.67 20.27,3.27 16.27,2.67 23.47,5.67 12.47,5.67 11.67,17.27
  pour Bottom: -5.33,52.07 -6.53,50.87 -6.53,6.87 6.67,-6.33 67.87,-6.33 81.47,7.27 81.47,43.67 69.47,55.67 -2.13,55.67 -5.33,52.47
  pour Top: 0.27,53.87 -3.93,49.67 -3.93,4.67 4.87,-4.13 66.67,-4.13 78.27,7.47 78.27,43.47 68.27,53.47 0.67,53.47
GPIO5/PHY-PWR  (via drill 0.3)
  Top 0.254: v43.07,28.47 43.21,28.61 U1.29
  Bottom 0.254: v43.07,28.47 42.47,28.47 37.97,23.97 T1.2
GPIO17/EMAC-CLK-OUT-180  (via drill 0.3)
  Top 0.254: 46.05,27.27 U1.28 31.93,27.34 v31.67,27.07 | U4.5 21.51,27.34 21.54,27.31 21.63,27.31 22.07,26.87 25.97,26.87 v26.49,26.34
  Bottom 0.254: v31.67,27.07 30.78,26.19 26.69,26.19 26.69,26.14 v26.49,26.34
GPIO18/MDIO(RMII)  (via drill 0.3)
  Top 0.254: U4.16 16.87,31.87 v18.27,33.27 18.44,33.44 25.13,33.44 26.3,32.27 v26.47,32.27 | U1.30 44.72,29.88 44.31,29.47 33.67,29.47 v30.87,32.27
  Bottom 0.254: RM3.8 23.39,33.68 23.2,33.49 18.49,33.49 v18.27,33.27 | v30.87,32.27 v26.47,32.27
GPIO19/EMAC-TXD0(RMII)  (via drill 0.3)
  Top 0.254: U4.23 15.25,25.84 v14.87,25.47 | v43.47,31.07 43.55,31.15 U1.31
  Bottom 0.254: v14.87,25.47 15.97,24.37 37.57,24.37 42.87,29.67 42.87,30.47 v43.47,31.07
GPIO21/EMAC-TX-EN(RMII)  (via drill 0.3)
  Top 0.254: U4.21 15.2,26.84 v15.07,26.97 | v43.67,33.67 46.1,33.67 U1.33
  Bottom 0.254: v15.07,26.97 15.77,26.97 17.27,25.47 36.47,25.47 41.07,30.07 41.07,33.07 41.67,33.67 v43.67,33.67
GPIO22/EMAC-TXD1(RMII)  (via drill 0.3)
  Top 0.254: U4.22 15.3,26.34 15.29,26.34 14.4,26.34 v14.27,26.47 | v41.87,32.47 41.87,35.87 43.5,37.5 U1.36
  Bottom 0.254: v14.27,26.47 14.47,26.27 15.52,26.27 16.85,24.94 37.14,24.94 41.87,29.67 v41.87,32.47
GPIO23/MDC(RMII)  (via drill 0.3)
  Top 0.254: U4.17 15.19,28.84 v15.14,28.89 | v44.27,38.67 46.02,38.67 U1.37
  Bottom 0.254: v15.14,28.89 15.93,29.67 19.47,29.67 21.07,31.27 25.07,31.27 25.67,30.67 30.67,30.67 32.67,32.67 32.67,33.27 35.87,36.47 39.47,36.47 41.67,38.67 v44.27,38.67
GPIO25/EMAC-RXD0-(RMII)  (via drill 0.3)
  Top 0.254: U4.11 19.38,31.37 v20.27,32.26 v20.28,32.27 | v26.07,31.47 27.67,29.87 27.67,28.87 27.93,28.61 U1.10
  Bottom 0.254: RM3.6 24.39,33.09 23.57,32.27 | 23.57,32.27 20.47,32.27 20.46,32.26 v20.27,32.26 | 23.57,32.27 25.07,32.27 25.87,31.47 v26.07,31.47
GPIO26/EMAC-RXD1(RMII)  (via drill 0.3)
  Top 0.254: U4.10 19.89,29.56 19.89,30.14 20.21,30.47 v21.87,30.47 23.54,30.47 RM2.5 | v27.47,27.27 27.54,27.34 U1.11
  Bottom 0.254: v21.87,30.47 21.87,29.47 21.47,29.07 21.47,27.27 21.74,26.99 26.94,26.99 27.21,27.27 v27.47,27.27
GPIO27/EMAC-RX-CRS-DV  (via drill 0.3)
  Top 0.254: U4.15 17.38,31.17 18.48,32.27 v18.68,32.47 19.16,32.95 23.59,32.95 26.83,29.71 26.83,26.91 27.67,26.07 U1.12
  Bottom 0.254: RM3.7 23.89,33.29 23.59,32.99 19.2,32.99 v18.68,32.47
H-CLK  (via drill 0.3)
  Top 0.254: U2.2 62.07,34.79 62.07,34.82 59.52,32.27 58.87,32.27 v58.07,31.47 | U1.13 29.19,24.87 v40.27,24.87
  Bottom 0.254: v58.07,31.47 58.07,26.07 57.67,25.67 41.07,25.67 v40.27,24.87
H-CS  (via drill 0.3)
  Top 0.254: U2.1 61.87,36.06 61.87,36.07 v58.87,33.07 | v42.27,24.87 42.07,24.66 U1.23
  Bottom 0.254: v58.87,33.07 58.87,25.47 58.47,25.06 42.47,25.06 v42.27,24.87
H-MISO  (via drill 0.3)
  Top 0.254: U1.14 30.53,23.53 31.04,24.04 40.44,24.04 43.02,26.62 v43.72,26.62 | U2.4 61.47,30.98 61.47,29.87 60.87,29.27 57.67,29.27 v57.27,28.87
  Bottom 0.254: v57.27,28.87 57.27,27.67 56.22,26.62 v43.72,26.62
H-MOSI  (via drill 0.3)
  Top 0.254: U1.16 33.18,20.96 45.87,13.67 47.67,12.47 v50.87,12.47 | U2.3 61.87,33.52 60.47,32.12 v60.47,30.67
  Bottom 0.254: v50.87,12.47 58.27,12.47 60.47,14.67 v60.47,30.67
INT1  (via drill 0.3)
  Top 0.254: U1.24 43.34,24.07 v43.27,24.07 | 65.07,41.27 v63.47,41.27 | C5.1 65.09,39.35 | R4.2 65.07,39.09 66.71,37.45 U2.12
  Top 0.4: C5.1 65.07,41.27 | 65.09,39.35 R4.2
  Bottom 0.254: v43.27,24.07 43.67,24.47 59.07,24.47 59.67,25.07 59.67,38.27 62.67,41.27 v63.47,41.27
KG1
  Top 0.254: U4.2 25.4,25.84 26.87,24.37 26.87,21.67 28.27,20.27 28.27,16.87 27.07,15.67 24.87,15.67 19.57,10.37 19.57,4.77 18.49,3.68 J6.10
KY1
  Bottom 0.254: J6.11 21.07,4.82 21.07,9.73 22.7,11.35 22.75,11.35 25.67,14.27 26.34,14.27 26.49,14.5 R27.2
LED  (via drill 0.35)
  Top 0.254: v48.27,27.47 48.27,26.27 48.07,26.07 U1.27
  Bottom 0.254: v48.27,27.47 50.07,29.27 50.07,34.27 56.07,40.27 56.63,40.27 R5.1
N$1
  Top 0.254: C3.2 68.26,32.13 U2.8
N$2
  Top 0.254: 47.01,23.53 U1.25 46.27,23.38 46.27,16.87 47.87,15.27 61.46,15.27 R1.1 59.87,17.88 59.87,18.6 | SW1_BOOT.2 59.87,18.6 | 59.87,18.6 SW1_BOOT.1
N$3
  Top 0.254: C7.2 69.54,34.79 U2.10
N$4  (via drill 0.3)
  Top 0.254: U1.8 28.19,31.15 27.47,31.87 27.47,34.87 26.67,35.67 v26.67,35.87
  Bottom 0.254: R3.1 26.67,36.12 v26.67,35.87
N$5
  Top 0.3: U1.3 27.24,37.5 25.87,38.87 25.87,39.05 SW2_EN.2 SW2_EN.1 18.87,41.23 18.87,44.07 19.54,44.73 R2.1
N$6
  Bottom 0.254: R3.2 22.9,39.1 Q1.1
N$7
  Top 0.254: J1.3 54.47,44.11 54.47,44.27 53.07,44.27 49.07,40.27 49.07,38.27 47.03,36.23 U1.35
N$8
  Top 0.254: J1.2 53.11,39.51 51.07,37.47 50.87,37.47 48.36,34.96 U1.34
N$9
  Top 0.4: U1.22 40.8,21.14 47.27,14.67 52.87,14.67 56.24,11.3 J3.1
N$10
  Top 0.4: U1.21 39.33,22.33 39.33,21.81 47.27,13.87 52.27,13.87 54.27,11.87 54.27,6.25 J3.2
N$11  (via drill 0.9)
  Top 0.6: R8.1 55.02,34.41 | 55.02,34.41 56.06,33.37 LED1.4-DIN | v56.07,35.47 55.02,34.41
  Bottom 0.6: Q2.3 56.17,35.47 v56.07,35.47
N$12
  Bottom 0.5: Q1.3 5.54,37.94 3.74,36.14 BUZ1.2
N$13
  Bottom 0.7: R7.2 40.6,21.71 T1.3
N$14
  Bottom 0.254: R5.2 58.37,40.17 Q2.1
N$15  (via drill 0.3)
  Top 0.254: U4.6 21.7,27.85 21.88,27.67 v22.27,27.67
  Bottom 0.254: v22.27,27.67 23.74,27.67 C16.2 23.88,29.78 C17.2
N$16
  Bottom 0.7: FET1.1 43.42,17.44 C21.1 43.65,17.21 R7.1 44.87,21.71 R6.2
N$17
  Top 0.254: LED1.2-DOUT 52.6,28.27 54.77,28.27 LED2.4-DIN
N$18  (via drill 0.3)
  Top 0.4: v21.87,11.63 J6.MH1 C20.2
  Bottom 0.4: v21.87,11.63 19.87,13.63 19.87,13.67 12.42,13.67 J6.MH2
  Bottom 0.5: J6.MH2 9.62,10.87 C19.2
N$19
  Top 0.4: LED2.2-DOUT 51.17,23.67 53.37,23.67 LED3.4-DIN
N$25  (via drill 0.25)
  Top 0.254: U4.19 v15.1,27.84
  Bottom 0.254: 14.21,27.87 R38.2 | R38.2 13.97,27.63 C18.2 | R38.2 14.19,27.84 v15.1,27.84
N$26
  Top 0.254: R39.1 22.32,24.64 U4.32
PHYAD0  (via drill 0.3)
  Top 0.254: v25.67,33.96 17.67,33.96 15.47,31.76 v15.47,30.7 15.47,30.67 | v18.01,30.7 18.38,30.33 U4.13
  Bottom 0.254: RM3.5 v25.67,33.96 | v15.47,30.7 v18.01,30.7
PHYAD1
  Top 0.254: RM2.8 23.58,28.34 U4.7
PHYAD2
  Top 0.254: RM2.7 22.54,29.14 22.25,28.84 U4.8
RMIISEL
  Top 0.254: RM2.6 20.47,29.64 U4.9
RX_N
  Top 0.203: U4.30 19.38,23.59 19.86,23.11 22.63,23.11 22.85,22.89 22.85,22.49 22.47,22.11 R28.1 22.26,21.55 22.79,21.01 22.79,20.19 21.11,18.51 21.11,16.67 20.86,16.41 19.13,16.41 arc-90 18.87,16.67 18.87,17.47 arc-90 19.07,17.67 19.83,17.67 J6.6
RX_P
  Top 0.203: J6.3 17.33,16.04 20.99,16.04 21.47,16.52 21.47,18.37 23.15,20.04 23.15,21.03 23.69,21.57 R31.1 23.57,22.13 23.2,22.49 23.2,23.04 22.77,23.47 20,23.47 19.88,23.6 U4.31
TX_N
  Top 0.203: J6.2 14.95,16.27 15.42,16.27 16.01,16.87 16.01,19.21 16.59,19.79 16.59,20.61 16.06,21.15 R32.1 16.36,22.11 16.51,22.27 16.51,23.02 16.97,23.47 18.25,23.47 18.45,23.67 18.45,23.74 18.38,23.81 U4.28
TX_P
  Top 0.203: J6.1 14.66,15.91 15.56,15.91 16.37,16.72 16.37,19.07 16.95,19.64 16.95,20.63 17.49,21.17 R33.1 17.01,22.13 16.87,22.27 16.87,22.87 17.11,23.11 18.39,23.11 18.8,23.52 18.8,23.74 18.88,23.81 U4.29
VDD1-2A  (via drill 0.35, 0.4)
  Top 0.3: U4.27 17.88,24.07 17.8,24.07 17.65,23.92 15.27,23.92 14.36,23 R32.2 | R31.2 25.87,22.61 25.87,24.54 25.07,25.34 U4.1
  Top 0.5: R33.2 19.87,22.13 | 19.87,22.13 20.54,22.13 R28.2 | 13.47,22.11 R32.2 14.36,21.91 | 13.47,22.11 12.48,22.11 R26.2 12.46,23.27 12.26,23.47 v9.07,23.47 | 19.87,22.13 v19.87,19.87 19.87,19.85 | R31.2 25.39,20.27 v25.47,20.27 | 13.47,22.11 13.47,21.27 14.47,20.27 v14.47,20.07
  Bottom 0.5: J6.4 18.76,16.2 J6.5 J6.7 23.94,14.93 25.47,16.47 v25.47,20.27 29,20.27 31.21,22.48 L3.2 | J6.4 17.49,18.27 16.69,19.07 14.87,19.07 14.47,19.47 v14.47,20.07 | v19.87,19.87 17.49,17.49 J6.4 | C24.2 10.95,26.06 | 10.95,26.06 C15.2 9.59,27.42 C14.2 | 10.95,26.06 10.06,26.06 9.07,25.07 v9.07,23.47 8.87,23.27 8.87,23.22 6.67,21.02 R25.1 R25.2 5.33,19.28 C11.2